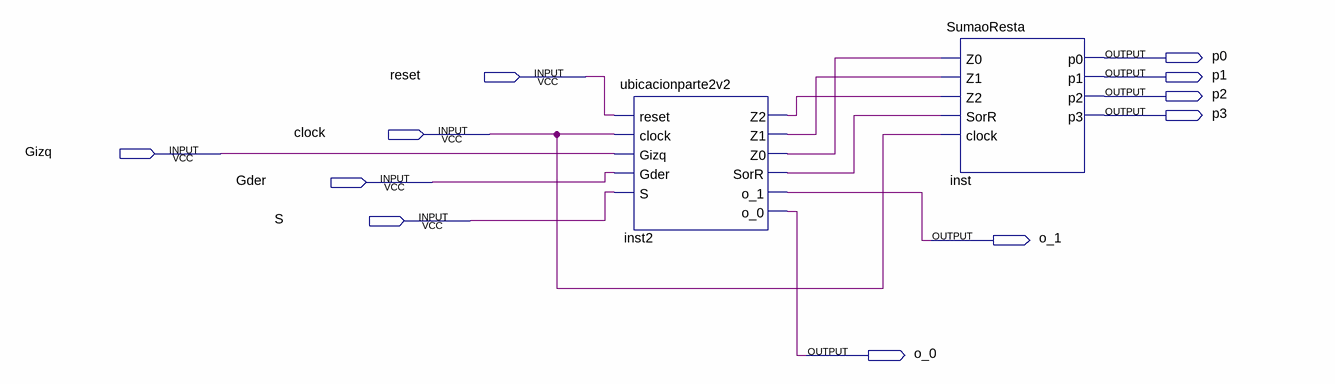
[diagram p0: schematic sheet]
// Quartus schematic ubicacion.bdf as structural Verilog: 2 symbols, 11 pins
module ubicacion (
  input  reset,
  input  clock,
  input  Gizq,
  input  Gder,
  input  S,
  output p0,
  output p1,
  output p2,
  output p3,
  output o_1,
  output o_0
);

  wire inst2_sorr, inst2_z0, inst2_z1, inst2_z2;

  ubicacionparte2v2 inst2 (
    .reset(reset), .clock(clock), .Gizq(Gizq), .Gder(Gder), .S(S), .Z2(inst2_z2), .Z1(inst2_z1),
    .Z0(inst2_z0), .SorR(inst2_sorr), .o_1(o_1), .o_0(o_0));
  SumaoResta inst (
    .Z0(inst2_z0), .Z1(inst2_z1), .Z2(inst2_z2), .SorR(inst2_sorr), .clock(clock), .p0(p0), .p1(p1), .p2(p2),
    .p3(p3));
endmodule
